# Altium project VENTUNOQ.PrjPcb (part 7 of 18)

## Sheet LOAD_SWITCH_5V.SchDoc: LOAD SWITCH 5V
size A3; Author: Silvio Navaretti; CompanyName: ARDUINO; DrawnBy: Silvio Navaretti; Engineer: Silvio Navaretti; Organization: ARDUINO; SheetNumber: 28; SheetTotal: 51; RevAuthor: Silvio Navaretti
Used 6 times, as channels U_USB/U_LOAD_SWITCH_5V, U_USB/U_LOAD_SWITCH_5V, U_ETH/U_ETH_PHY/U_LOAD_SWITCH_5V, U_POWER/U_LOAD_SWITCH_5V, U_POWER/U_LOAD_SWITCH_5V, U_PCIE/U_PCIE_NVME/U_LOAD_SWITCH_5V. Parts and nets are listed once, with the designators drawn on the sheet.
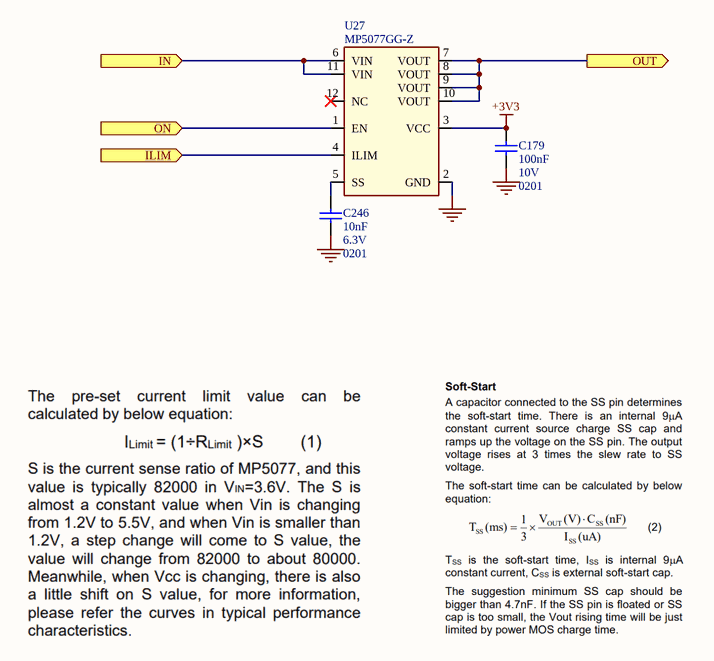
[diagram p17: LOAD_SWITCH_5V.SchDoc]

### Parts
C179  value 100nF  Voltage: 10V  Case Code (Imperial): 0201  [CAP-0201]  (hidden comment: CL03A104KP3NNNC)
C246  value 10nF  Voltage: 6.3V  Case Code (Imperial): 0201  [CAP-0201]  (hidden comment: GRM033R70J103KA01D)
U27  MP5077GG-Z  [MPS QFN12 2x2mm pitch 0.4mm]

### Ports
ILIM (in), IN (in), ON (in), OUT (out)

### Nets
+3V3: C179.2 U27.3(VCC)
GND: C179.1 C246.1 U27.2(GND)
ILIM: U27.4(ILIM) ; port ILIM
IN: U27.6(VIN) U27.11(VIN) ; port IN
ON: U27.1(EN) ; port ON
OUT: U27.7(VOUT) U27.8(VOUT) U27.9(VOUT) U27.10(VOUT) ; port OUT
NetC246_2: C246.2 U27.5(SS)

Not connected (* = marked no-connect by the designer): U27 12(NC)*

### Channels
U_USB/U_LOAD_SWITCH_5V: designators end in _1; ports ILIM=NetR25_2 IN=+5V ON=NetR182_2 OUT=NetC35_2
U_USB/U_LOAD_SWITCH_5V: designators end in _2; ports ILIM=NetR26_2 IN=+5V ON=NetR154_2 OUT=NetC147_2
U_ETH/U_ETH_PHY/U_LOAD_SWITCH_5V: designators end in _3; ports ILIM=NetR342_2 IN=+1V8 ON=NetC36_2 OUT=DVDD18
U_POWER/U_LOAD_SWITCH_5V: designators end in _4; ports ILIM=NetR339_2 IN=+5V ON=NetR336_2 OUT=+5V_LIMITED
U_POWER/U_LOAD_SWITCH_5V: designators end in _5; ports ILIM=NetR341_2 IN=+3V3 ON=NetR337_2 OUT=+3V3_LIMITED
U_PCIE/U_PCIE_NVME/U_LOAD_SWITCH_5V: designators end in _6; ports ILIM=NetR183_2 IN=+3V3 ON=MD_GPIO_51 OUT=NetC224_2

### Notes on the sheet
- Title:
- ID:
- Date:
- Time:
- Version:
- Sheet
- of
- RevAuthor:
- Reference Designs ARE PROVIDED "AS IS" AND "WITH ALL FAULTS. Arduino SA DISCLAIMS ALL OTHER WARRANTIES, EXPRESS OR IMPLIED, REGARDING PRODUCTS, INCLUDING BUT NOT LIMITED TO, ANY IMPLIED WARRANTIES OF MERCHANTABILITY OR FITNESS FOR A PARTICULAR PURPOSE.
  Arduino SA may make changes to specifications and product descriptions at any time, without notice. The Customer must not rely on the absence or characteristics of any features or instructions marked "reserved" or "undefined".
  Arduino SA reserves these for future definition and shall have no responsibility whatsoever for conflicts or incompatibilities arising from future changes to them. The product information on the Web Site or Materials is subject to change without notice.
  Do not finalize a design with this info. ARDUINO and other Arduino brands and logos and Trademarks of Arduino SA. All Arduino SA Trademarks cannot be used without owner's formal permission.
- File:
- Author:

### Library data of the parts
C179 = C0113-A.6: as C54-C60 on sheet USB_MUX; Technology: Ceramic; Part Number: CL03A104KP3NNNC; Dielectric: X5R; Tolerance: 10%
C246 = C0112-A.6: CAP CHIP 0201 10nF 10% 6.3V X7R; Manufacturer: Murata; Code Arduino: C0112; Tolerance: 10%; Part Number: GRM033R70J103KA01D; Manufacturer 2: Yageo; Technology: Ceramic; Dielectric: X7R
U27 = U0512-A.2: IC Load Switch Vload 0.5V to 5.5V, 10mR at 5V, max 7A, programmable overcurrent limit, linear ramp control, logic ON 1.7V, VCC 3V to 5.5V, -40 to 125°C, QFN12 2x2mm; Manufacturer: MPS; Code Arduino: U0512; Part Number: MP5077GG-Z

## Sheet ETH.SchDoc: ETH
size A3; Author: Silvio Navaretti; CompanyName: ARDUINO; DrawnBy: Silvio Navaretti; Engineer: Silvio Navaretti; Organization: ARDUINO; SheetNumber: 35; SheetTotal: 50; RevAuthor: Silvio Navaretti
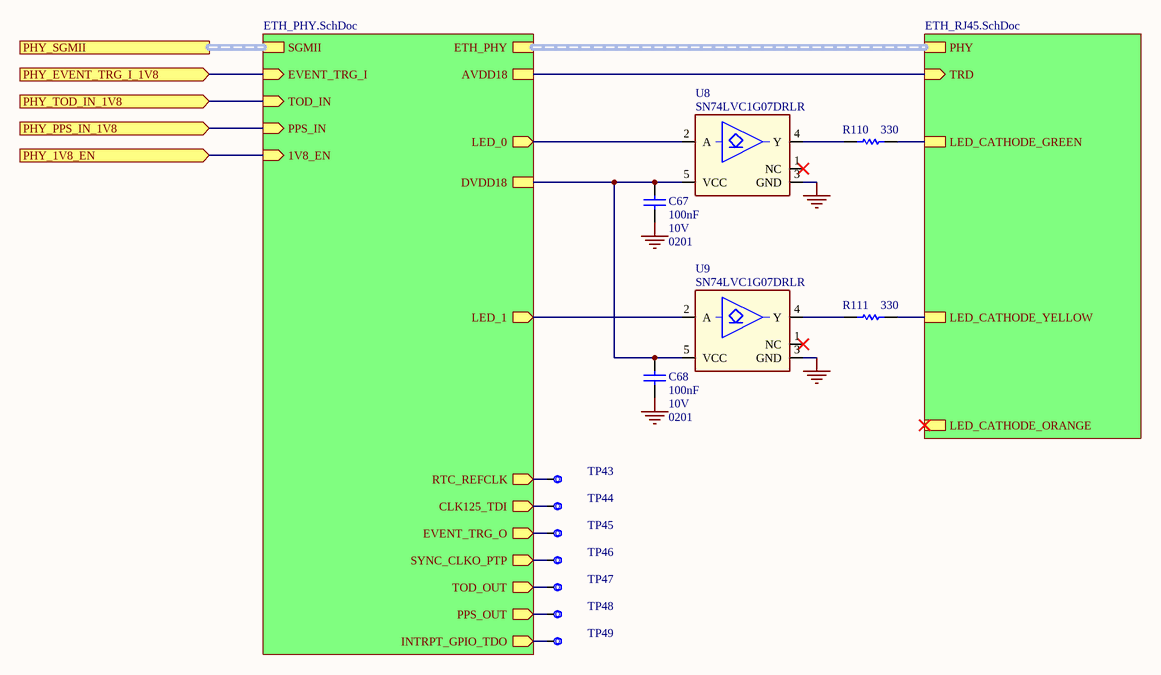
[diagram p18: ETH.SchDoc]

### Parts
C67  value 100nF  Voltage: 10V  Case Code (Imperial): 0201  [CAP-0201]  (hidden comment: CL03A104KP3NNNC)
C68  value 100nF  Voltage: 10V  Case Code (Imperial): 0201  [CAP-0201]  (hidden comment: CL03A104KP3NNNC)
R110  value 330  [RES-0201]  (hidden comment: AC0201FR-07330RL)
R111  value 330  [RES-0201]  (hidden comment: AC0201FR-07330RL)
TP43  Test point 1.00mm  [TP-1.00MM]  (value not drawn)  (no BOM)
TP44  Test point 1.00mm  [TP-1.00MM]  (value not drawn)  (no BOM)
TP45  Test point 1.00mm  [TP-1.00MM]  (value not drawn)  (no BOM)
TP46  Test point 1.00mm  [TP-1.00MM]  (value not drawn)  (no BOM)
TP47  Test point 1.00mm  [TP-1.00MM]  (value not drawn)  (no BOM)
TP48  Test point 1.00mm  [TP-1.00MM]  (value not drawn)  (no BOM)
TP49  Test point 1.00mm  [TP-1.00MM]  (value not drawn)  (no BOM)
U8  SN74LVC1G07DRLR  [TI DRL DRL0005A]
U9  SN74LVC1G07DRLR  [TI DRL DRL0005A]

### Sub-sheets
U_ETH_PHY = ETH_PHY.SchDoc: ETH_PHY (harness ETH_QCA8081), SGMII (harness SOM_MD_SGMII0), LED_0 (out), LED_1 (out), CLK125_TDI (out), EVENT_TRG_O (out), SYNC_CLKO_PTP (out), TOD_OUT (out), PPS_OUT (out), EVENT_TRG_I (in), INTRPT_GPIO_TDO (out), PPS_IN (in), RTC_REFCLK (out), TOD_IN (in), AVDD18, 1V8_EN (in), DVDD18
U_ETH_RJ45 = ETH_RJ45.SchDoc: LED_CATHODE_GREEN, LED_CATHODE_ORANGE, LED_CATHODE_YELLOW, PHY (harness ETH_QCA8081), TRD (in)

### Ports
PHY_1V8_EN (in), PHY_EVENT_TRG_I_1V8 (in), PHY_PPS_IN_1V8 (in), PHY_SGMII, PHY_TOD_IN_1V8 (in)

### Nets
GND: C67.1 C68.1 U8.3(GND) U9.3(GND)
1V05_PG (PULLUP 1V8): port PHY_1V8_EN, sheet U_ETH_PHY/1V8_EN
DVDD18: C67.2 C68.2 U8.5(VCC) U9.5(VCC) ; sheet U_ETH_PHY/DVDD18
NetC12_2: sheet U_ETH_PHY/AVDD18, sheet U_ETH_RJ45/TRD
NetJ2_13: R111.1 ; sheet U_ETH_RJ45/LED_CATHODE_YELLOW
NetJ2_17: R110.1 ; sheet U_ETH_RJ45/LED_CATHODE_GREEN
NetR62_1: TP45.X ; sheet U_ETH_PHY/EVENT_TRG_O
NetR63_1: TP44.X ; sheet U_ETH_PHY/CLK125_TDI
NetR64_1: TP46.X ; sheet U_ETH_PHY/SYNC_CLKO_PTP
NetR65_1: TP47.X ; sheet U_ETH_PHY/TOD_OUT
NetR66_1: U9.2(A) ; sheet U_ETH_PHY/LED_1
NetR67_1: U8.2(A) ; sheet U_ETH_PHY/LED_0
NetR68_1: TP48.X ; sheet U_ETH_PHY/PPS_OUT
NetR110_2: R110.2 U8.4(Y)
NetR111_2: R111.2 U9.4(Y)
NetTP40_X: port PHY_EVENT_TRG_I_1V8, sheet U_ETH_PHY/EVENT_TRG_I
NetTP41_X: port PHY_TOD_IN_1V8, sheet U_ETH_PHY/TOD_IN
NetTP42_X: port PHY_PPS_IN_1V8, sheet U_ETH_PHY/PPS_IN
NetTP43_X: TP43.X ; sheet U_ETH_PHY/RTC_REFCLK
NetTP49_X: TP49.X ; sheet U_ETH_PHY/INTRPT_GPIO_TDO

Not connected (* = marked no-connect by the designer): U8 1(NC)*; U9 1(NC)*

### Buses and harness runs
harness port PHY_SGMII = sheet U_ETH_PHY/SGMII
harness sheet U_ETH_PHY/ETH_PHY = sheet U_ETH_RJ45/PHY

### Notes on the sheet
- Title:
- ID:
- Date:
- Time:
- Version:
- Sheet
- of
- RevAuthor:
- Reference Designs ARE PROVIDED "AS IS" AND "WITH ALL FAULTS. Arduino SA DISCLAIMS ALL OTHER WARRANTIES, EXPRESS OR IMPLIED, REGARDING PRODUCTS, INCLUDING BUT NOT LIMITED TO, ANY IMPLIED WARRANTIES OF MERCHANTABILITY OR FITNESS FOR A PARTICULAR PURPOSE.
  Arduino SA may make changes to specifications and product descriptions at any time, without notice. The Customer must not rely on the absence or characteristics of any features or instructions marked "reserved" or "undefined".
  Arduino SA reserves these for future definition and shall have no responsibility whatsoever for conflicts or incompatibilities arising from future changes to them. The product information on the Web Site or Materials is subject to change without notice.
  Do not finalize a design with this info. ARDUINO and other Arduino brands and logos and Trademarks of Arduino SA. All Arduino SA Trademarks cannot be used without owner's formal permission.
- File:
- Author:

### Library data of the parts
C67 C68 = C0113-A.6: as C54-C60 on sheet USB_MUX; Technology: Ceramic; Part Number: CL03A104KP3NNNC; Dielectric: X5R; Tolerance: 10%
R110 R111 = R0149-A.21: RES CHIP 0201 330R 1% 1/20W; Manufacturer: Yageo; Code Arduino: R0149; Power: 50mW; Temperature coefficient: 200ppm; Case Code (Imperial): 0201; Technology: Thick film; Part Number: AC0201FR-07330RL; Manufacturer 2: Samsung Electro-Mechanics; Tolerance: 1%
TP43-TP49 = UT0013-A.6: Part Number: This is not a component; Design Item ID: CMP-018-0005-A.3; Source: ut.SchLib; Manufacturer: This is not a component; Code Arduino: This is not a component; Pin Count: 1
U8 U9 = U0494-A.2: IC buffer open drain, 1.65V to 5.5V, 32mA sink current, SOT-5X3 1.6mmx1.6mm; Manufacturer: Texas Instruments; Code Arduino: U0494; Part Number: SN74LVC1G07DRLR